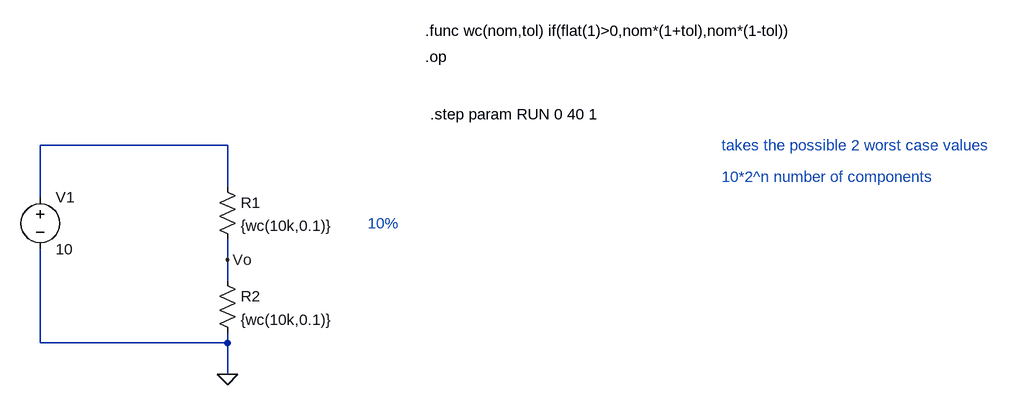
[diagram p0: schematic WORST CASE.asc]
WORST CASE.asc, the LTspice schematic file:
Version 4.1
SHEET 1 1304 680
WIRE 96 32 -192 32
WIRE 96 96 96 32
WIRE -192 112 -192 32
WIRE 96 208 96 176
WIRE 96 240 96 208
WIRE -192 336 -192 192
WIRE 96 336 96 320
WIRE 96 336 -192 336
WIRE 96 384 96 336
FLAG 96 384 0
FLAG 96 208 Vo
SYMBOL res 80 80 R0
SYMATTR InstName R1
SYMATTR Value {wc(10k,0.1)}
SYMBOL res 80 224 R0
SYMATTR InstName R2
SYMATTR Value {wc(10k,0.1)}
SYMBOL voltage -192 96 R0
WINDOW 123 0 0 Left 0
WINDOW 39 0 0 Left 0
SYMATTR InstName V1
SYMATTR Value 10
TEXT 400 -144 Left 2 !.func wc(nom,tol) if(flat(1)>0,nom*(1+tol),nom*(1-tol))
TEXT 400 -104 Left 2 !.op
TEXT 312 152 Left 2 ;10%
TEXT 856 32 Left 2 ;takes the possible 2 worst case values
TEXT 856 80 Left 2 ;10*2^n number of components
TEXT 408 -16 Left 2 !.step param RUN 0 40 1

The netlist it stands for:
* WORST CASE.asc
R1 N001 Vo {wc(10k,0.1)}
R2 Vo 0 {wc(10k,0.1)}
V1 N001 0 10
.func wc(nom,tol) if(flat(1)>0,nom*(1+tol),nom*(1-tol))
.op
* 10%
* takes the possible 2 worst case values
* 10*2^n number of components
.step param RUN 0 40 1
.backanno
.end